# EAGLE design synth-zodiac-pisces-vco-mod (EAGLE 9.6.2)
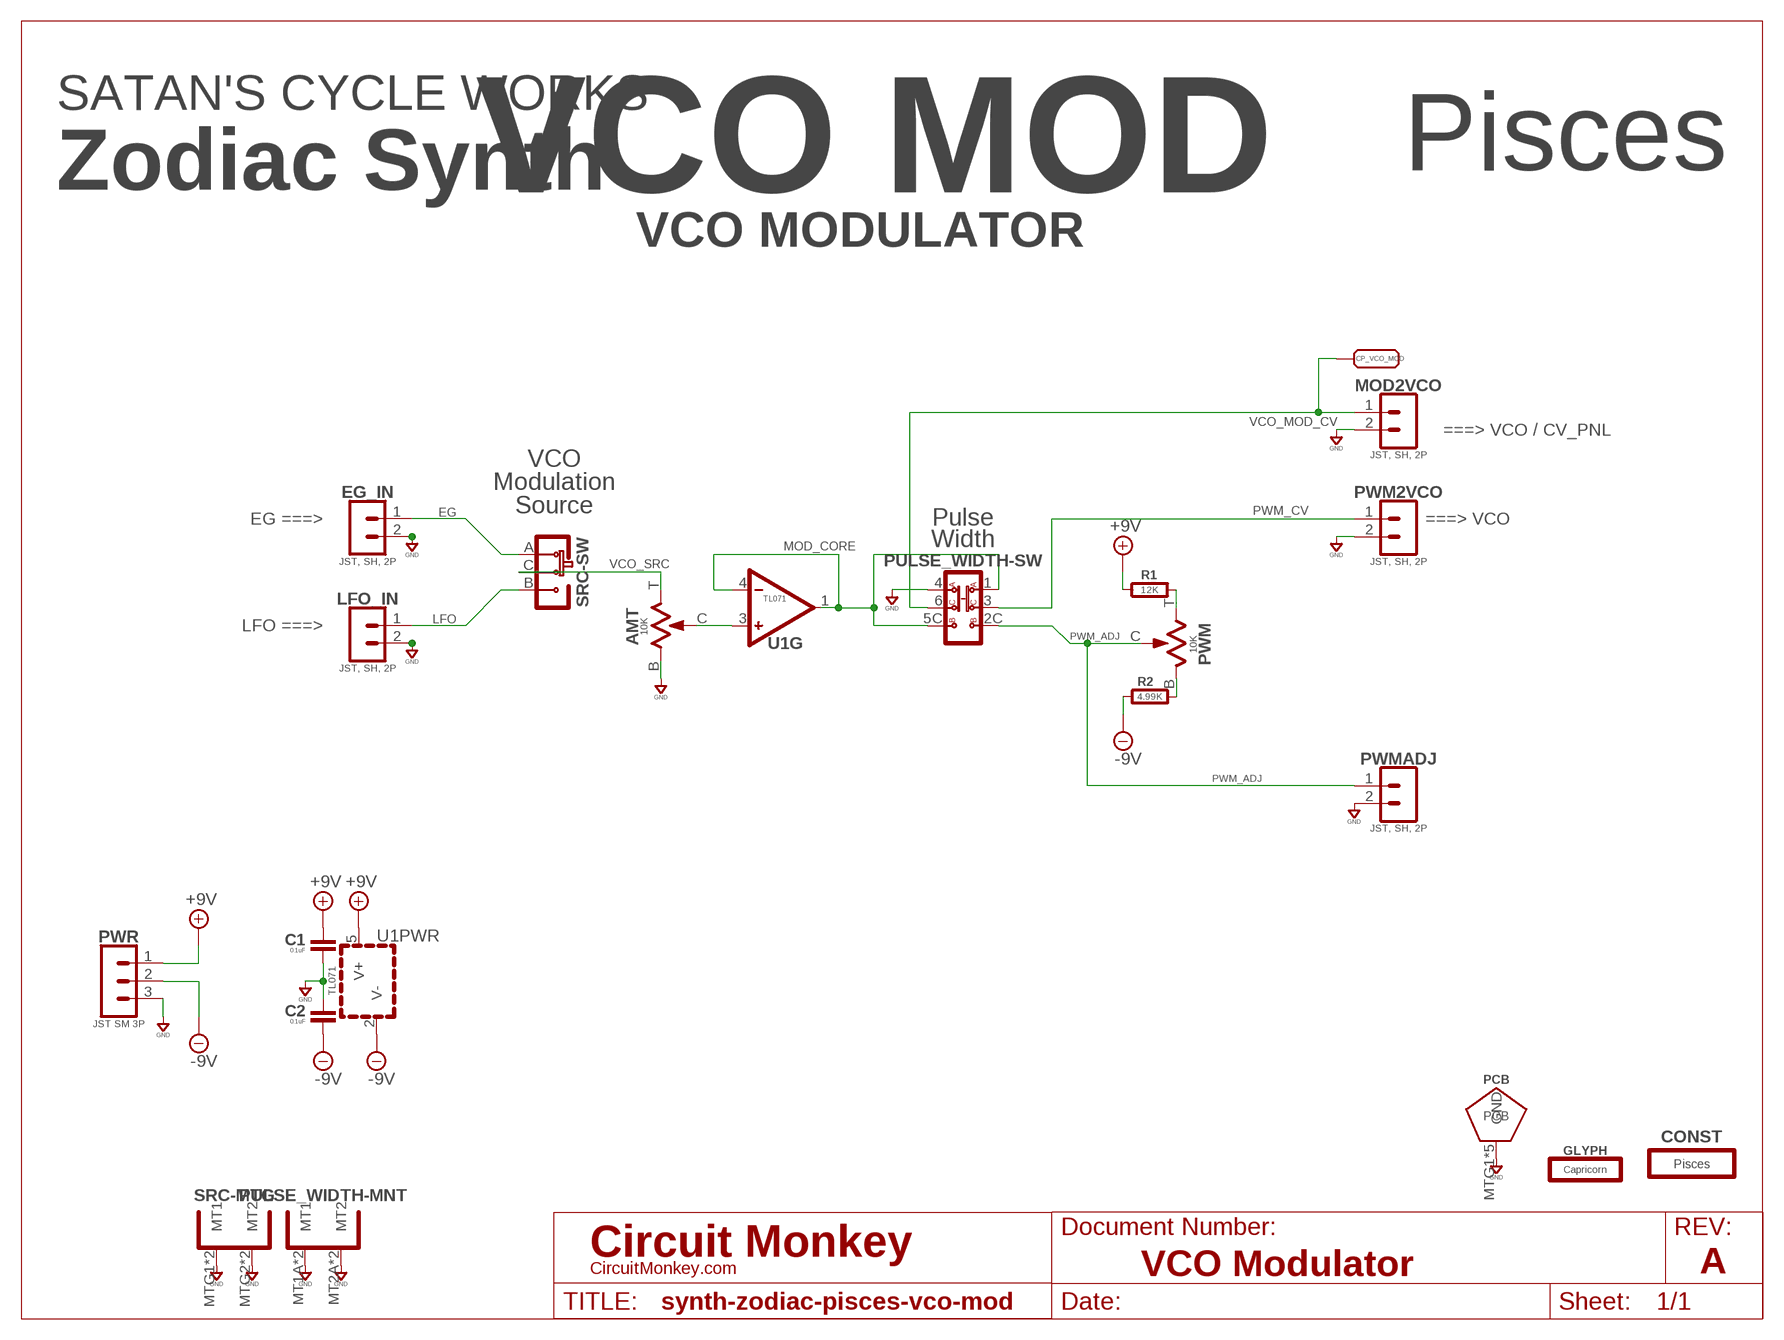
[diagram p0: schematic, sheet 1]
SHEET3 (LETTER_L-CIRCUITMONKEY): DOCUMENT_NUMBER: VCO Modulator; REV: A

## Parts
AMT  10K  TRIMPOT9MM_PCB_SHAFT  [POT-RV9110]
C1  0.1uF  CAPACITOR0603  [0603-CAP]
C2  0.1uF  CAPACITOR0603  [0603-CAP]
CONST  Pisces  CONSTELLATION-PISCES  [PISCES-CONST]
CP_VCO_MOD  PADSMD-070X070  [SMD-070MIL]
EG_IN  JST, SH, 2P  02P-SM-VT-SMT  [BM02B-SRSS-TB]
GLYPH  Capricorn  GLYPH-CAPRICORN  [CAPRICORN-GLYPH]
LFO_IN  JST, SH, 2P  02P-SM-VT-SMT  [BM02B-SRSS-TB]
MOD2VCO  JST, SH, 2P  02P-SM-VT-SMT  [BM02B-SRSS-TB]
PCB  PCB FAB  PENTAGON-40R  [PENTAGON-40MM-RAD]
PULSE_WIDTH  Switch, DPDT  SLIDE-DPDT-MNTPNL-SMD-TOGGLE-ONLY  [CK_OS202013MT5-PNL-SMT-2]
PWM  10K  TRIMPOT9MM_PCB_SHAFT  [POT-RV9110]
PWM2VCO  JST, SH, 2P  02P-SM-VT-SMT  [BM02B-SRSS-TB]
PWMADJ  JST, SH, 2P  02P-SM-VT-SMT  [BM02B-SRSS-TB]
PWR  JST SM 3P  03P-SM-VT-SMT  [BM03B-SRSS-TB]
R1  12K  RESISTOR0603  [0603-RES]
R2  4.99K  RESISTOR0603  [0603-RES]
SRC  SLIDE-SPDT-MNTSS-12-F45-TH-PCB-2  [SS-12-F45-PNL-SMT-2]
U1  TL071  SINGLE-TL071  [SOT-23-5]

## Nets
+9V: C1.1 PWR.1 R1.1 U1.5(PWR:V+)
-9V: C2.2 PWR.2 R2.2 U1.2(PWR:V-)
EG: EG_IN.1 SRC.A(-SW:A)
GND: AMT.B C1.2 C2.1 EG_IN.2 LFO_IN.2 MOD2VCO.2 PCB.MTG1(GND) PCB.MTG2(GND) PCB.MTG3(GND) PCB.MTG4(GND) PCB.MTG5(GND) PULSE_WIDTH.4(-SW:2A) PULSE_WIDTH.MT1A(-MNT:MT1) PULSE_WIDTH.MT2A(-MNT:MT2) PULSE_WIDTH.MT3A(-MNT:MT1) PULSE_WIDTH.MT4A(-MNT:MT2) PWM2VCO.2 PWMADJ.2 PWR.3 SRC.MTG1(-MTG:MT1) SRC.MTG2(-MTG:MT2) SRC.MTG3(-MTG:MT1) SRC.MTG4(-MTG:MT2)
LFO: LFO_IN.1 SRC.B(-SW:B)
MOD_CORE: PULSE_WIDTH.1(-SW:1A) PULSE_WIDTH.5C(-SW:2B) U1.1(G:OUT) U1.4(G:-)
N$86: AMT.C U1.3(G:+)
N$97: PWM.B R2.1
N$98: PWM.T R1.2
PWM_ADJ: PULSE_WIDTH.2C(-SW:1B) PWM.C PWMADJ.1
PWM_CV: PULSE_WIDTH.3(-SW:1C) PWM2VCO.1
VCO_MOD_CV: CP_VCO_MOD.1(PAD) MOD2VCO.1 PULSE_WIDTH.6(-SW:2C)
VCO_SRC: AMT.T SRC.C(-SW:C)

## Notes on the sheet
- VCO MOD | Pisces
- SATAN'S CYCLE WORKS
- Zodiac Synth
- VCO MODULATOR
- ===> VCO / CV_PNL
- VCO
  Modulation
  Source
- EG ===> | ===> VCO
- Pulse
  Width
- LFO ===>

## Library data of the parts
AMT PWM = rlc:TRIMPOT: Potentiometer; COST01: 0.70; COST10: 0.60; COST100: 0.60; MFR: Tayda; MPN: RV9110NO-OS15A00; SKU: A-5517
C1 C2 = rlc:CAPACITOR: Capacitor; COST01: 0.12; COST10: 0.09; COST100: 0.05
CONST = circuit-monkey-zodiac:CONSTELLATION: Constellations
CP_VCO_MOD = con-testpoints:PAD: Solder Pad
EG_IN LFO_IN MOD2VCO PWM2VCO PWMADJ = con-jst:02P: 2 pin connector; COST01: 0.45; COST10: 0.4; COST100: 0.35; MFR: JST; MPN: BMB02B-SRSS-TB
GLYPH = circuit-monkey-zodiac:GLYPH: Glyph
PCB = circuit-monkey-zodiac:PENTAGON: Pentagram shaped PCB
PULSE_WIDTH = switch-thd:SLIDE-DPDT-MNT: DPDT Slide Switch with mounting pins; MFR: CK; MPN: OS202013MT5QN1
PWR = con-jst:03P: 3 pin connector; COST01: 0.60; COST10: 0.45; COST100: 0.38; MFR: JST; MPN: BM03B-SRSS-TB
R1 R2 = rlc:RESISTOR: Resistor; COST01: 0.10; COST10: 0.05; COST100: 0.02
SRC = switch-thd:SLIDE-SPDT-MNT: Slide Switch, SPDT; COST01: 0.15; COST10: 0.12; COST100: 0.12; MFR: Tayda; MPN: A-659/A-5111/A-5104
U1 = op-amp:SINGLE: Single channel Op-amp; COST01: 0.46; COST10: 0.37; COST100: 0.29; MFR: TI; MPN: TL071HIDBV

## Board
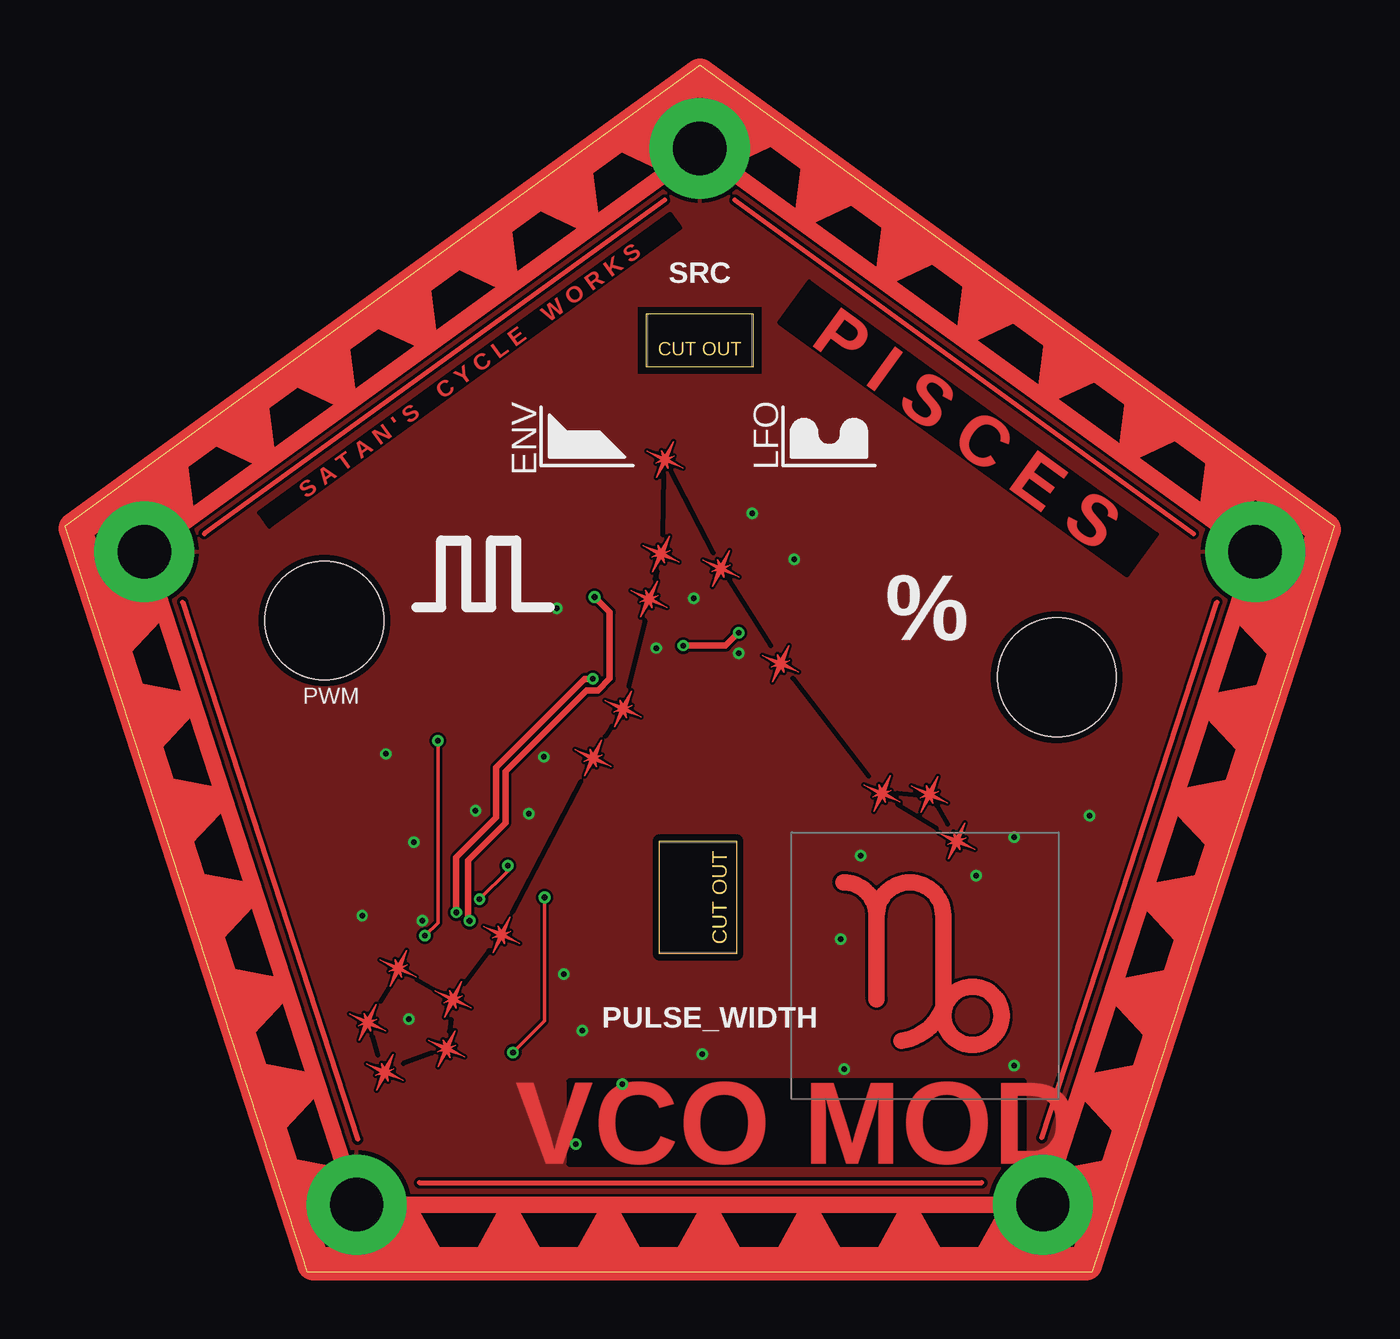
[diagram p1: board, top side]
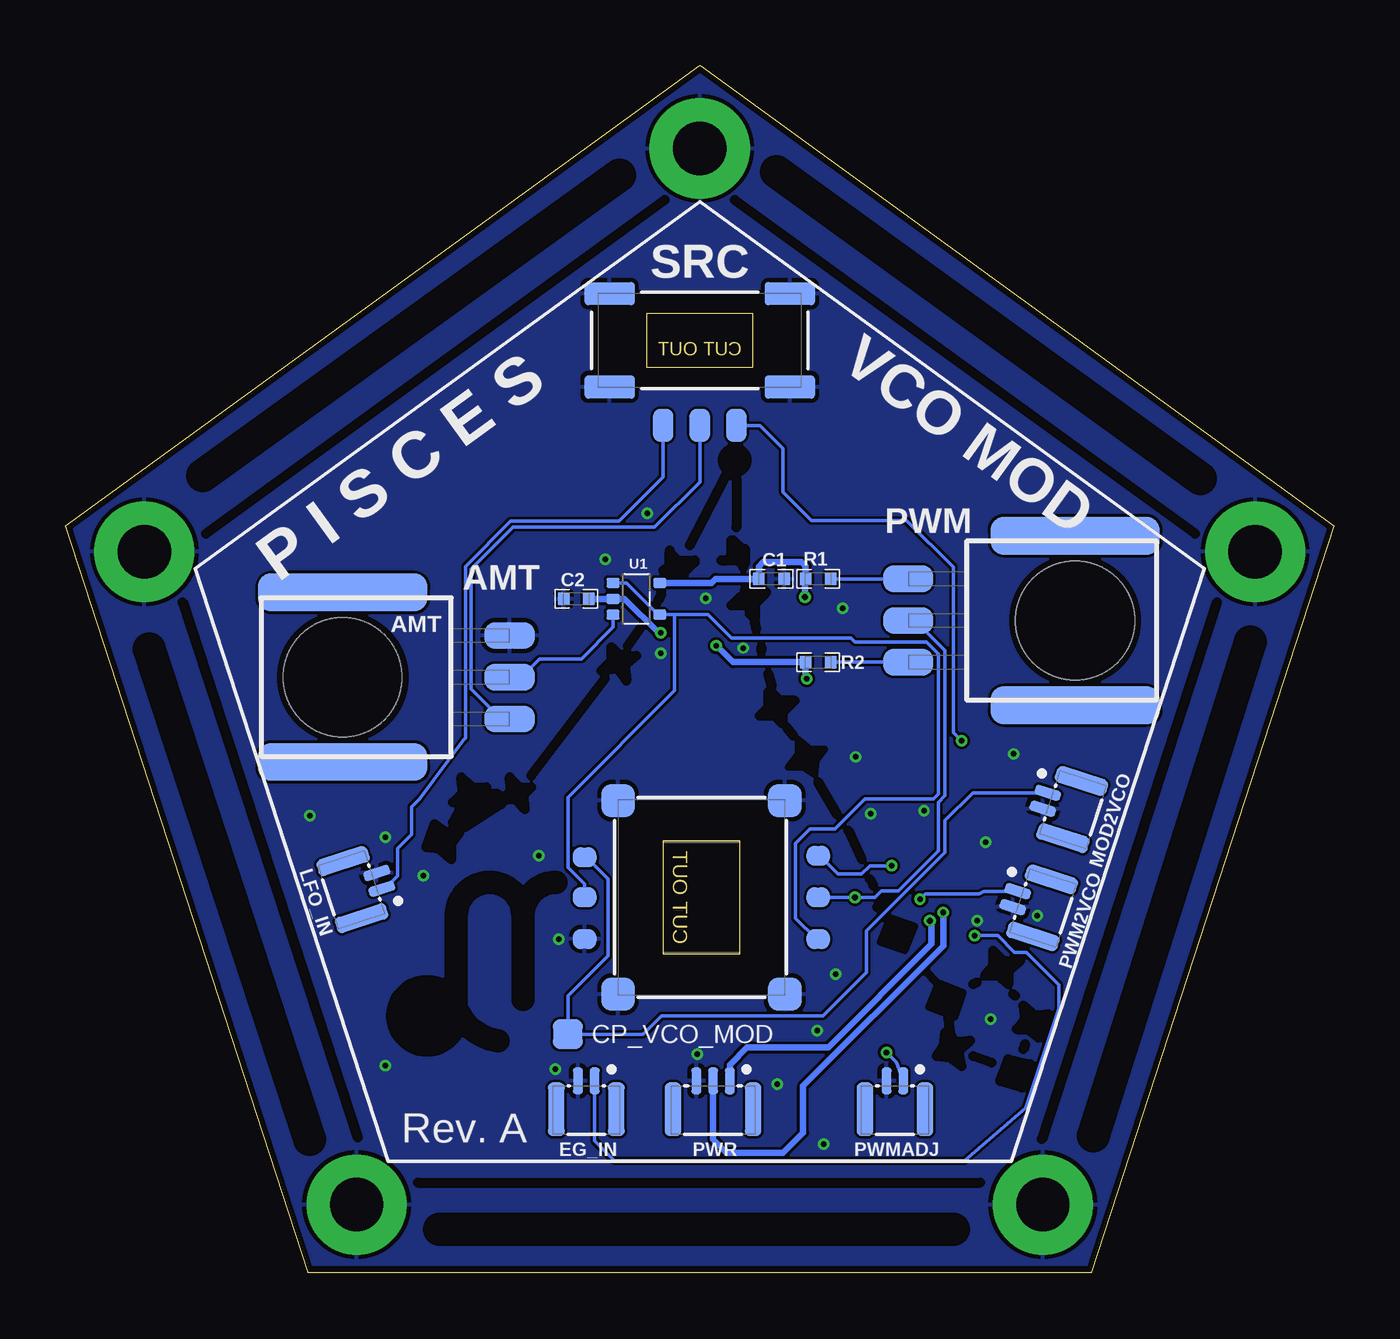
[diagram p2: board, bottom side, seen from below]

Size 76.08 x 72.36 mm. Coordinates in mm from the lower left corner, seen from the top.
Copper layers (1*16): Top 0.0356mm / dielectric 1.5011mm / Bottom 0.0356mm
Design rules "OSH-CircuitMonkey *": minimum track width 0.2mm, minimum drill 13mil, track to track 6mil, track to pad 6mil, pad to pad 6mil, via to via 6mil, smd to smd 6mil, copper to edge 15mil, drill to drill 6mil, minimum pad ring 7mil, minimum via ring 7mil, stop-mask expansion 3mil, vias tented up to drill 15mil, thermal gap 10mil
bRestrict: area 32.3,32.9 to 34.4,34.8; area 30.5,29.8 to 32.7,32; area 25.1,19.3 to 27.2,21.3; area 22.2,15.3 to 24.3,17.4; area 34.9,47.7 to 36.9,49.7; 117 lines

### Footprints (pad centres in the part's own frame; a part is rotated, then mirrored left to right if it is on the bottom)
POT-RV9110 = smd 1.6 x 3: B 2.5,-10; C 0,-10; T -2.5,-10 | smd 2.286 x 10.16: MNT1 -5.08,0; MNT2 5.08,0 | hole 7.1: 0,0
0603-CAP = smd 0.711 x 0.762: 1 -0.752,0; 2 0.752,0
SMD-070MIL = smd 1.778 x 1.778: 1 0.508,0
BM02B-SRSS-TB = smd 0.6 x 1.6: 1 -0.5,-0.3; 2 0.5,-0.3 | smd 1 x 3.2: MTG1 1.8,1.4; MTG2 -1.8,1.4
PENTAGON-40MM-RAD = drill 3.2 pad 6: MTG1 0,35; MTG2 33.3,10.82; MTG3 20.57,-28.32; MTG4 -20.57,-28.32; MTG5 -33.3,10.82
CK_OS202013MT5-PNL-SMT-2 = smd 1.2 x 1.4 bottom: 1 -2.5,7; 2C 0,7; 3 2.5,7; 4 -2.5,-7; 5C 0,-7; 6 2.4,-7 | smd 2 x 2 bottom: MT1A -5.8,-5; MT2A 5.8,-5; MT3A -5.8,5; MT4A 5.8,5
BM03B-SRSS-TB = smd 0.6 x 1.6: 1 -1,-0.3; 2 0,-0.3; 3 1,-0.3 | smd 1 x 3.2: MTG1 2.4,1.4; MTG2 -2.4,1.4
0603-RES = smd 0.711 x 0.762: 1 -0.752,0; 2 0.752,0
SS-12-F45-PNL-SMT-2 = smd 1.2 x 2 bottom: A -2.2,-5.1; B 2.2,-5.1; C 0,-5.1 | smd 3 x 1.4 bottom: MTG1 -5.4,2.8; MTG2 5.4,2.8; MTG3 -5.4,-2.8; MTG4 5.4,-2.8
SOT-23-5 = smd 0.6 x 0.8: 1 -0.95,-1.4; 2 0,-1.4; 3 0.95,-1.4; 4 0.95,1.4; 5 -0.95,1.4

### Placement (x,y rotation side)
AMT  59.44,35.66 90 bottom
C1  33.74,41.56 0 bottom
C2  45.44,40.36 0 bottom
CONST  37.54,23.76 335 top
CP_VCO_MOD  45.44,14.26 180 bottom
EG_IN  44.84,11.16 180 bottom
GLYPH  51.64,18.36 0 top
LFO_IN  57.54,23.36 108 bottom
MOD2VCO  17.04,28.16 252 bottom
PCB  38.04,32.36 0 top
PULSE_WIDTH  37.94,22.46 90 top
PWM  15.54,39.06 270 bottom
PWM2VCO  18.84,22.26 252 bottom
PWMADJ  26.34,11.16 180 bottom
PWR  37.24,11.16 180 bottom
R1  30.94,41.56 0 bottom
R2  30.94,36.56 180 bottom
SRC  38.04,55.86 0 top
U1  41.84,40.36 270 bottom

### Tracks (layer width: path | path; a pad name or v marks a point on that pad's centre or on a via)
+9V  (via drill 0.35)
  Top 0.4: v24.24,21.06 24.14,21.16 24.14,24.68 26.39,26.93 26.39,30.01 31.25,34.87 31.93,34.87 32.64,35.58 32.64,39.56 v31.74,40.46
  Bottom 0.4: U1.5 37.34,41.31 37.09,41.56 C1.1 34.49,42.31 34.24,42.56 31.94,42.56 31.69,42.31 R1.1 31.74,41.51 v31.74,40.46 | PWR.1 36.24,12.43 35.2,13.47 30.34,13.47 24.14,19.66 24.14,20.96 v24.24,21.06
-9V  (via drill 0.33)
  Top 0.4: v37.04,37.56 39.59,37.56 v40.37,38.34 | v31.64,35.56 31.14,35.56 25.84,30.26 25.84,27.24 23.45,24.85 v23.45,21.57 v23.44,21.56
  Bottom 0.4: C2.2 U1.2 42.54,40.36 40.52,38.34 v40.37,38.34 | v37.04,37.56 36.04,36.56 R2.2 31.69,35.71 31.64,35.66 v31.64,35.56 | v23.44,21.56 23.44,19.56 31.84,11.16 31.84,8.36 33.04,7.16 36.44,7.16 37.24,7.96 PWR.2
EG  (via drill 0.33)
  Top 0.2: v22.34,31.86 22.34,20.94 v21.57,20.17
  Bottom 0.2: v21.57,20.17 20.17,20.17 19.17,19.17 18.47,19.17 16.53,17.23 16.53,15.78 18.48,9.84 22.17,6.66 43.14,6.66 44.34,7.86 EG_IN.1 | v22.34,31.86 22.84,32.36 22.84,42.26 25.64,45.06 31.34,45.06 33.04,46.76 33.04,49.36 34.44,50.76 SRC.A
GND  (via drill 0.33)
  other vias: 35.44,37.41 41.18,45.49 43.7,42.73 28.7,30.88 20.9,25.77 19.23,31.06 30.6,7.67 31,14.47 33.4,11.27 46.7,12.17 56.9,12.37 61.4,27.37 56.9,26.07 54.6,23.77 17.8,21.37 47.7,24.97 29.9,17.87 37.68,40.39 29.48,39.79 40.38,37.09 27.8,27.47 24.6,27.67 21.4,21.07 38.2,13.07 20.6,15.17 46.5,19.97
  pour Bottom: 61.34,0.26 75.8,44.7 38.04,72.06 0.44,44.56 14.83,0.44
  pour Top (rank 4): 17.64,4.36 58.54,4.36 71.04,42.86 37.84,67.01 5.04,43.16
LFO
  Bottom 0.2: LFO_IN.1 56.9,22.98 56.14,23.74 56.14,25.39 55.31,26.22 55.31,27.9 54.84,28.36 52.24,31.86 52.09,32.01 52.09,42.31 49.39,45.01 42.89,45.01 40.24,47.66 SRC.B
MOD_CORE
  Bottom 0.2: U1.4 37.54,39.41 36.14,38.01 28.99,38.01 28.74,37.76 24.44,37.76 23.74,37.06 23.74,28.66 24.04,28.36 28.14,28.36 29.94,26.56 31.44,26.56 32.29,25.71 32.29,21.21 31.04,19.96 PULSE_WIDTH.1 | U1.4 39.54,39.41 39.54,34.86 45.94,28.46 45.94,24.26 44.94,23.26 PULSE_WIDTH.5C | U1.1 42.44,41.31 40.54,39.41 U1.4
N$86
  Bottom 0.2: U1.3 43.24,38.66 45.14,36.76 47.64,36.76 48.74,35.66 AMT.C
N$97
  Bottom 0.2: PWM.B R2.1
N$98
  Bottom 0.2: PWM.T R1.2
PWM_ADJ  (via drill 0.35)
  Top 0.2: v28.74,22.46 28.74,15.06 v26.84,13.16
  Bottom 0.2: PWM.C 25.14,39.06 23.34,37.26 23.34,28.56 23.74,28.16 23.74,25.26 26.14,22.86 27.14,22.86 27.54,22.46 v28.74,22.46 PULSE_WIDTH.2C | v26.84,13.16 26.25,12.57 PWMADJ.1
PWM_CV  (via drill 0.33)
  Top 0.2: v24.84,22.36 26.54,24.06 v26.54,24.36
  Bottom 0.2: v26.54,24.36 27.84,24.36 28.34,23.86 29.74,23.86 30.84,24.96 PULSE_WIDTH.3 | PWM2VCO.1 21.01,22.83 21.3,22.68 24.53,22.68 v24.84,22.36
VCO_MOD_CV
  Bottom 0.2: MOD2VCO.1 21.67,28.73 23.34,27.06 23.34,25.16 28.04,20.46 28.04,17.96 30.65,15.35 36.14,15.35 36.15,15.36 40.34,15.36 41.44,14.26 CP_VCO_MOD.1 45.95,16.56 43.54,18.97 43.54,23.56 44.84,24.86 PULSE_WIDTH.6
VCO_SRC
  Bottom 0.2: AMT.T 49.94,33.16 51.74,34.96 51.74,42.16 49.24,44.66 40.74,44.66 38.04,47.36 SRC.C

### Text on the board
Top: S A T A N ' S C Y C L E W O R K S | P I S C E S | VCO MOD
tPlace: ENV | LFO | %
bPlace: VCO MOD | P I S C E S | Rev. A
tStop: S A T A N ' S C Y C L E W O R K S | P I S C E S | VCO MOD